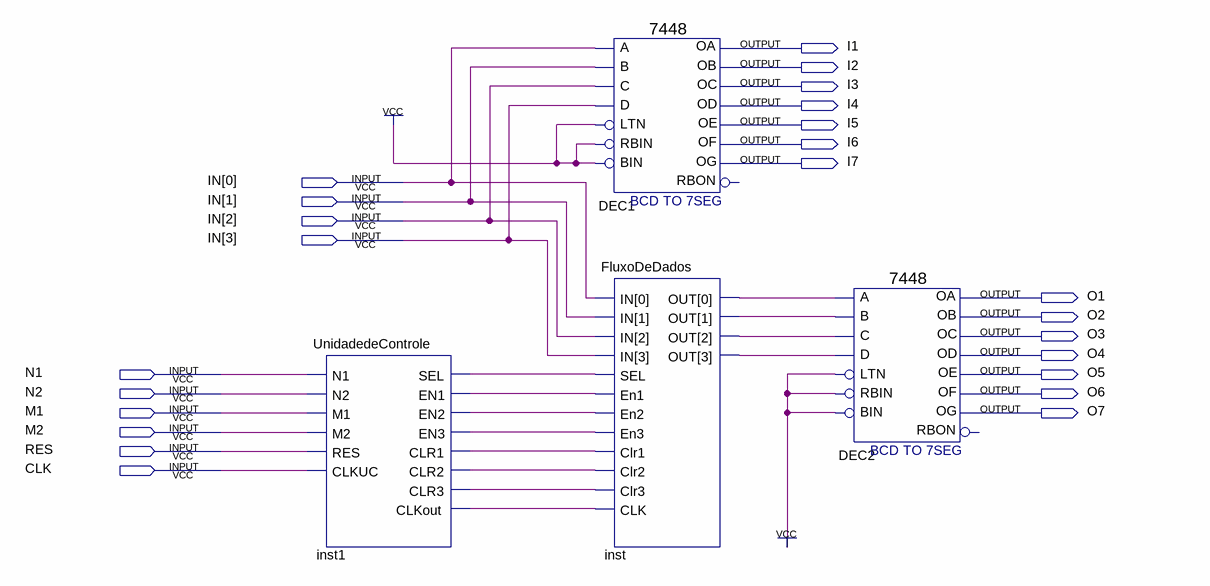
[diagram p0: schematic sheet]
// Quartus schematic Integracao.bdf as structural Verilog: 4 symbols, 24 pins
module Integracao (
  input  [3:0] IN,
  input  N1,
  input  N2,
  input  M1,
  input  M2,
  input  RES,
  input  CLK,
  output I1,
  output I2,
  output I3,
  output I4,
  output I5,
  output I6,
  output I7,
  output O1,
  output O2,
  output O3,
  output O4,
  output O5,
  output O6,
  output O7
);

  wire inst1_clkout, inst1_clr1, inst1_clr2, inst1_clr3, inst1_en1, inst1_en2, inst1_en3, inst1_sel,
       inst_out, inst_out_2, inst_out_3, inst_out_4;

  UnidadedeControle inst1 (
    .N1(N1), .N2(N2), .M1(M1), .M2(M2), .RES(RES), .CLKUC(CLK), .SEL(inst1_sel), .EN3(inst1_en3),
    .EN1(inst1_en1), .EN2(inst1_en2), .CLR1(inst1_clr1), .CLR2(inst1_clr2), .CLR3(inst1_clr3),
    .CLKout(inst1_clkout));
  \7448  DEC1 (
    .A(IN[0]), .C(IN[2]), .D(IN[3]), .B(IN[1]), .RBIN(1'b1), .BIN(1'b1), .LTN(1'b1), .OC(I3), .OE(I5),
    .OD(I4), .OF(I6), .OG(I7), .OB(I2), .OA(I1));  // open: RBON
  FluxoDeDados inst (
    .SEL(inst1_sel), .IN(IN), .En3(inst1_en3), .En1(inst1_en1), .Clr1(inst1_clr1), .En2(inst1_en2),
    .Clr3(inst1_clr3), .Clr2(inst1_clr2), .CLK(inst1_clkout),
    .OUT({inst_out, inst_out_2, inst_out_3, inst_out_4}));
  \7448  DEC2 (
    .A(inst_out_4), .C(inst_out_2), .D(inst_out), .B(inst_out_3), .RBIN(1'b1), .BIN(1'b1), .LTN(1'b1),
    .OC(O3), .OE(O5), .OD(O4), .OF(O6), .OG(O7), .OB(O2), .OA(O1));  // open: RBON
endmodule
